# EAGLE board MonthCalendar_Controller_v0.9 (EAGLE 9.4.1)
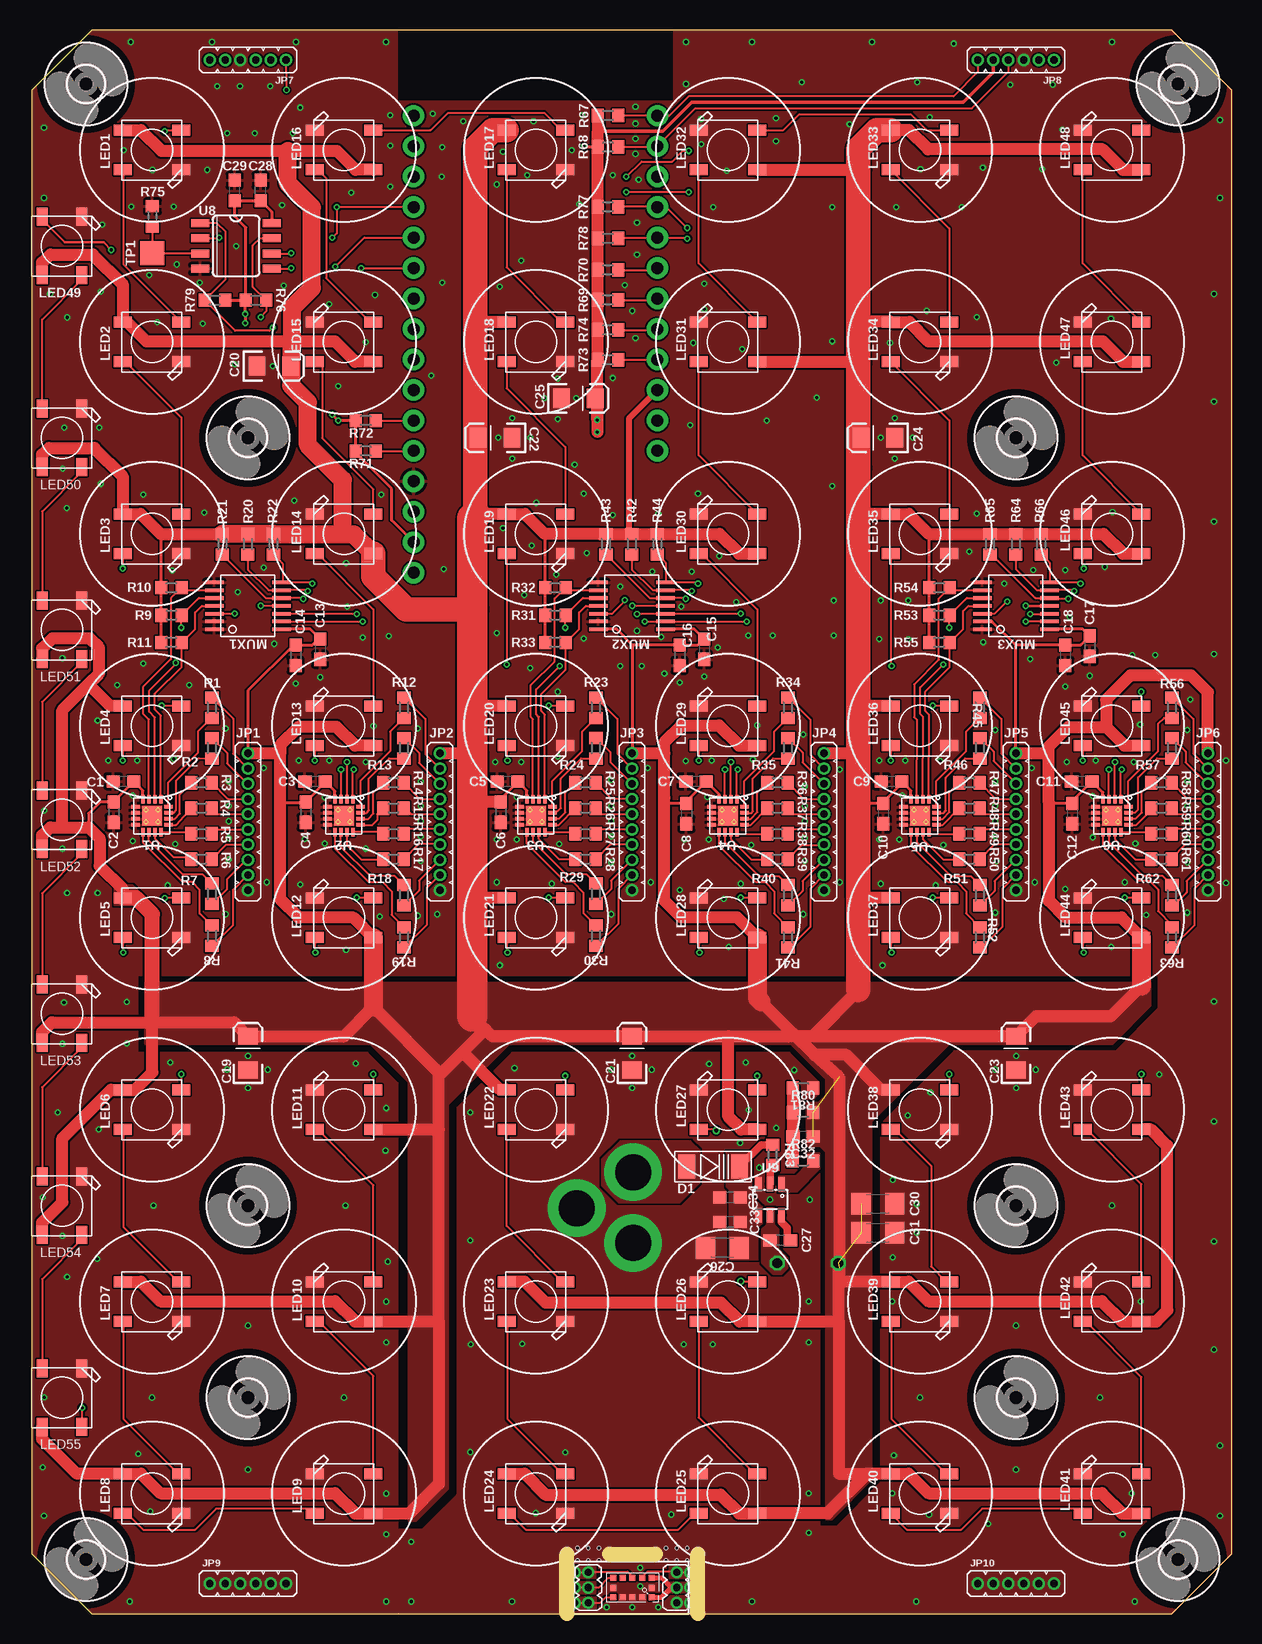
[diagram p5: board, top side]
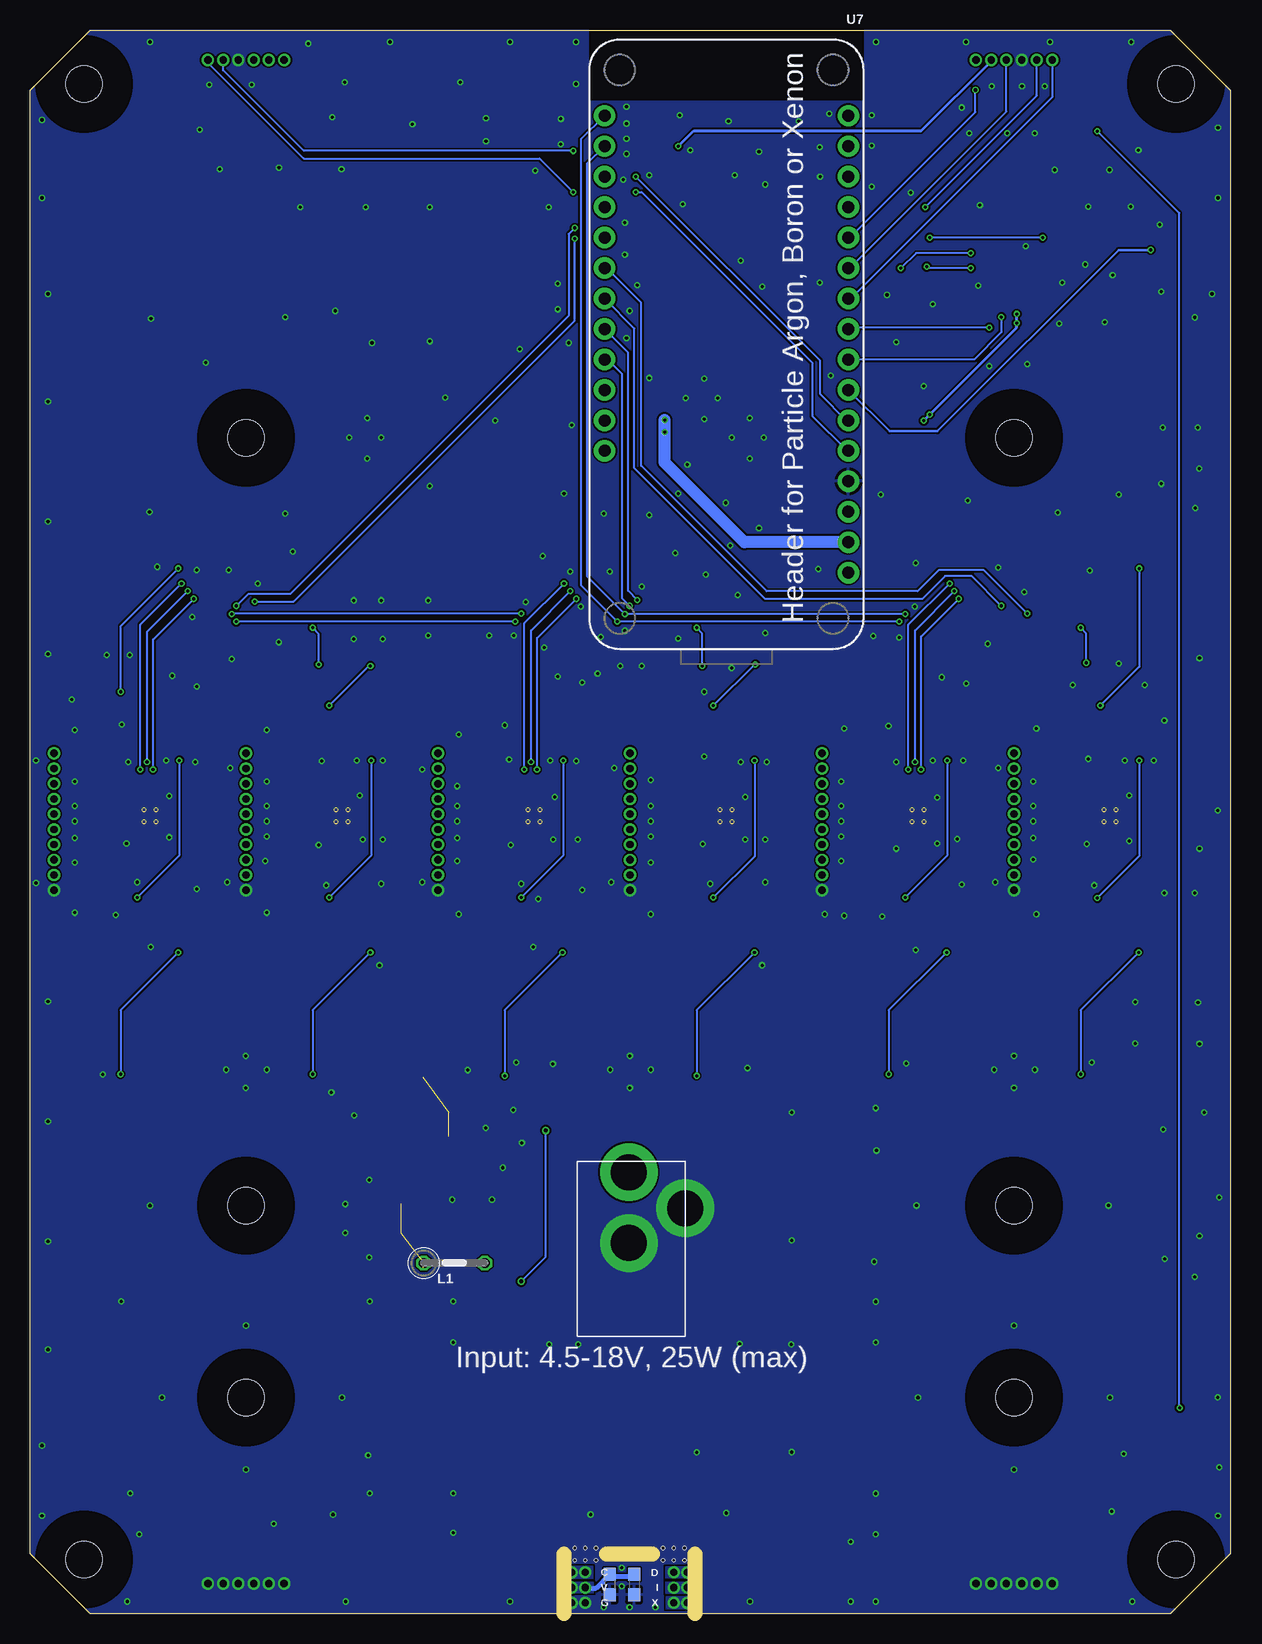
[diagram p6: board, bottom side, seen from below]

Size 100 x 132 mm. Coordinates in mm from the lower left corner, seen from the top.
Outline: 0,127 0,5 5,0 95,0 100,5 100,127 95,132 5,132 0,127
Copper layers (1*16): Top 0.035559375mm / dielectric 1.6mm / Bottom 0.035559375mm
Design rules "oshpark-2layer-tented *": minimum track width 6mil, minimum drill 10mil, track to track 6mil, track to pad 6mil, pad to pad 6mil, via to via 6mil, smd to smd 6mil, copper to edge 0mil, drill to drill 6mil, minimum pad ring 5mil, minimum via ring 5mil, stop-mask expansion 2.5mil, vias tented up to drill 20mil, thermal gap 10mil
Holes 0.25 mm at 47.24,4.45 46.35,4.45 45.47,4.45 47.24,5.46 46.35,5.46 45.47,5.46 54.61,5.46 53.72,5.46 52.83,5.46 54.61,4.45 53.72,4.45 52.83,4.45
Milling: 3 lines

## Footprints (pad centres in the part's own frame; a part is rotated, then mirrored left to right if it is on the bottom)
C0603 = smd 1.1 x 1: 1 -0.85,0; 2 0.85,0
PINHEAD_1X3_50MIL = drill 0.6 pad 1: P$1 0,1.27; P$2 0,0; P$3 0,-1.27
VL53L0X = smd 0.5 x 0.5: 1 1.6,-0.8; 2 0.8,-0.8; 3 0,-0.8; 4 -0.8,-0.8; 5 -1.6,-0.8; 6 -1.6,0; 7 -1.6,0.8; 8 -0.8,0.8; 9 0,0.8; 10 0.8,0.8; 11 1.6,0.8; 12 1.6,0
EIA3216 = smd 1.4 x 1.6: A 1.4,0; C -1.4,0
C1206 = smd 1.6 x 1.8: 1 -1.4,0; 2 1.4,0
SOD-128 = smd 2 x 1.4: ANODE 0,-2.2; CATHODE 0,2.2
CON_PINHEADER_10P_1R_TH_HARWIN_M50-3531042 = drill 0.6 pad 1.016: 1 -5.715,0; 2 -4.445,0; 3 -3.175,0; 4 -1.905,0; 5 -0.635,0; 6 0.635,0; 7 1.905,0; 8 3.175,0; 9 4.445,0; 10 5.715,0
CON_PINHEADER_6P_1R_TH_HARWIN_M50-3530642 = drill 0.6 pad 1.016: 1 -3.175,0; 2 -1.905,0; 3 -0.635,0; 4 0.635,0; 5 1.905,0; 6 3.175,0
0207/5V = drill 0.813 octagon: 1 -2.54,0; 2 2.54,0
WS2812B = smd 1.5 x 0.9: 1-VDD 2.45,-1.65; 2-DOUT 2.45,1.65; 3-GND -2.45,1.65; 4-DIN -2.45,-1.65
TSSOP-14 = smd 0.3 x 1.55: 1 -1.95,2.8; 2 -1.3,2.8; 3 -0.65,2.8; 4 0,2.8; 5 0.65,2.8; 6 1.3,2.8; 7 1.95,2.8; 8 1.95,-2.8; 9 1.3,-2.8; 10 0.65,-2.8; 11 0,-2.8; 12 -0.65,-2.8; 13 -1.3,-2.8; 14 -1.95,-2.8
PJ-102A = drill 3 pad 4.8: RING 0.1,-3.39; RING_SW -4.6,-6.29; TIP 0.1,-9.29
R0603 = smd 1 x 1.1: 1 -0.85,0; 2 0.85,0
TP20SQ = smd 2 x 2: TP 0,0
QFN-16-3X3 = smd 0.69 x 0.28: 1 -1.37,0.75; 2 -1.37,0.25; 3 -1.37,-0.25; 4 -1.37,-0.75; 9 1.37,-0.75; 10 1.37,-0.25; 11 1.37,0.25; 12 1.37,0.75 | smd 0.28 x 0.69: 5 -0.75,-1.37; 6 -0.25,-1.37; 7 0.25,-1.37; 8 0.75,-1.37; 13 0.75,1.37; 14 0.25,1.37; 15 -0.25,1.37; 16 -0.75,1.37 | smd 1.6 x 1.6: PAD 0,0
ARGON = drill 1 pad 1.778: 1 1.27,44.45; 2 1.27,41.91; 3 1.27,39.37; 4 1.27,36.83; 5 1.27,34.29; 6 1.27,31.75; 7 1.27,29.21; 8 1.27,26.67; 9 1.27,24.13; 10 1.27,21.59; 11 1.27,19.05; 12 1.27,16.51; 13 1.27,13.97; 14 1.27,11.43; 15 1.27,8.89; 16 1.27,6.35; 17 21.59,6.35; 18 21.59,8.89; 19 21.59,11.43; 20 21.59,13.97; 21 21.59,16.51; 22 21.59,19.05; 23 21.59,21.59; 24 21.59,24.13; 25 21.59,26.67; 26 21.59,29.21; 27 21.59,31.75; 28 21.59,34.29
SOIC-8_NARROW = smd 0.66 x 1.524: 1 -1.905,-2.973; 2 -0.635,-2.973; 3 0.635,-2.973; 4 1.905,-2.973; 5 1.905,2.973; 6 0.635,2.973; 7 -0.635,2.973; 8 -1.905,2.973
SOT-23-6 = smd 0.55 x 1.2: 1 -0.95,-1.3; 2 0,-1.3; 3 0.95,-1.3; 4 0.95,1.3; 5 0,1.3; 6 -0.95,1.3
3,0 = hole 3: 0,0

## Placement (x,y rotation side)
BO_C1  0.1uF  [C0603]  49.66,2.41 270 bottom
BO_C2  1uF  [C0603]  51.69,2.41 270 bottom
BO_JP1  PINHEAD_1X350MIL  [PINHEAD_1X3_50MIL]  53.72,2.16 180 top
BO_JP2  PINHEAD_1X350MIL  [PINHEAD_1X3_50MIL]  46.35,2.16 180 top
BO_U1  VL53L0X  [VL53L0X]  50.04,2.16 0 top
C1  0.1uF  [C0603]  7.62,69.36 180 top
C2  1uF  [C0603]  6.8,66.8 270 top
C3  0.1uF  [C0603]  23.6,69.36 180 top
C4  1uF  [C0603]  22.81,66.8 270 top
C5  0.1uF  [C0603]  39.62,69.36 180 top
C6  1uF  [C0603]  39.06,66.8 270 top
C7  0.1uF  [C0603]  55.35,69.36 180 top
C8  1uF  [C0603]  54.54,66.68 270 top
C9  0.1uF  [C0603]  71.62,69.36 180 top
C10  1uF  [C0603]  70.92,66.68 270 top
C11  0.1uF  [C0603]  87.48,69.36 180 top
C12  1uF  [C0603]  86.67,66.68 270 top
C13  0.1uF  [C0603]  24,80.39 270 top
C14  1uF  [C0603]  21.97,79.88 270 top
C15  0.1uF  [C0603]  56.01,80.39 270 top
C16  1uF  [C0603]  53.98,79.88 270 top
C17  0.1uF  [C0603]  88.14,80.64 270 top
C18  1uF  [C0603]  86.11,79.88 270 top
C19  47uF  [EIA3216]  18,46.73 90 top
C20  47uF  [EIA3216]  20.15,103.97 0 top
C21  47uF  [EIA3216]  50,46.73 90 top
C22  47uF  [EIA3216]  38.6,98 180 top
C23  47uF  [EIA3216]  82,46.73 90 top
C24  47uF  [EIA3216]  70.5,98 180 top
C25  47uF  [EIA3216]  45.53,101.3 0 top
C26  22uF  [C1206]  57.53,30.48 180 top
C27  0.1uF  [C0603]  62.36,31.11 180 top
C28  0.1uF  [C0603]  19.05,118.62 90 top
C29  1uF  [C0603]  16.89,118.62 90 top
C30  22uF  [C1206]  70.48,34.16 0 top
C31  22uF  [C1206]  70.48,31.75 0 top
C32  47-82pF  [C0603]  64.26,39.75 180 top
C33  0.1uF  [C0603]  58.17,32.64 180 top
C34  1uF  [C0603]  58.17,34.67 180 top
D1  DIODE  [SOD-128]  56.75,37.25 270 top
JP1  CON_10POS_1ROWHARWIN_M3531042  [CON_PINHEADER_10P_1R_TH_HARWIN_M50-3531042]  18,66 270 top
JP2  CON_10POS_1ROWHARWIN_M3531042  [CON_PINHEADER_10P_1R_TH_HARWIN_M50-3531042]  34,66 270 top
JP3  CON_10POS_1ROWHARWIN_M3531042  [CON_PINHEADER_10P_1R_TH_HARWIN_M50-3531042]  50,66 270 top
JP4  CON_10POS_1ROWHARWIN_M3531042  [CON_PINHEADER_10P_1R_TH_HARWIN_M50-3531042]  66,66 270 top
JP5  CON_10POS_1ROWHARWIN_M3531042  [CON_PINHEADER_10P_1R_TH_HARWIN_M50-3531042]  82,66 270 top
JP6  CON_10POS_1ROWHARWIN_M3531042  [CON_PINHEADER_10P_1R_TH_HARWIN_M50-3531042]  98,66 270 top
JP7  CON_6POS_1ROW6P1R_M50_35306  [CON_PINHEADER_6P_1R_TH_HARWIN_M50-3530642]  18,129.5 180 top
JP8  CON_6POS_1ROW6P1R_M50_35306  [CON_PINHEADER_6P_1R_TH_HARWIN_M50-3530642]  82,129.5 180 top
JP9  CON_6POS_1ROW6P1R_M50_35306  [CON_PINHEADER_6P_1R_TH_HARWIN_M50-3530642]  18,2.5 0 top
JP10  CON_6POS_1ROW6P1R_M50_35306  [CON_PINHEADER_6P_1R_TH_HARWIN_M50-3530642]  82,2.5 0 top
L1  4.7uH  [0207/5V]  64.64,29.21 0 bottom
LED1  WS2812B5050  [WS2812B]  10,122 180 top
LED2  WS2812B5050  [WS2812B]  10,106 180 top
LED3  WS2812B5050  [WS2812B]  10,90 180 top
LED4  WS2812B5050  [WS2812B]  10,74 180 top
LED5  WS2812B5050  [WS2812B]  10,58 180 top
LED6  WS2812B5050  [WS2812B]  10,42 180 top
LED7  WS2812B5050  [WS2812B]  10,26 180 top
LED8  WS2812B5050  [WS2812B]  10,10 180 top
LED9  WS2812B5050  [WS2812B]  26,10 0 top
LED10  WS2812B5050  [WS2812B]  26,26 0 top
LED11  WS2812B5050  [WS2812B]  26,42 0 top
LED12  WS2812B5050  [WS2812B]  26,58 0 top
LED13  WS2812B5050  [WS2812B]  26,74 0 top
LED14  WS2812B5050  [WS2812B]  26,90 0 top
LED15  WS2812B5050  [WS2812B]  26,106 0 top
LED16  WS2812B5050  [WS2812B]  26,122 0 top
LED17  WS2812B5050  [WS2812B]  42,122 180 top
LED18  WS2812B5050  [WS2812B]  42,106 180 top
LED19  WS2812B5050  [WS2812B]  42,90 180 top
LED20  WS2812B5050  [WS2812B]  42,74 180 top
LED21  WS2812B5050  [WS2812B]  42,58 180 top
LED22  WS2812B5050  [WS2812B]  42,42 180 top
LED23  WS2812B5050  [WS2812B]  42,26 180 top
LED24  WS2812B5050  [WS2812B]  42,10 180 top
LED25  WS2812B5050  [WS2812B]  58,10 0 top
LED26  WS2812B5050  [WS2812B]  58,26 0 top
LED27  WS2812B5050  [WS2812B]  58,42 0 top
LED28  WS2812B5050  [WS2812B]  58,58 0 top
LED29  WS2812B5050  [WS2812B]  58,74 0 top
LED30  WS2812B5050  [WS2812B]  58,90 0 top
LED31  WS2812B5050  [WS2812B]  58,106 0 top
LED32  WS2812B5050  [WS2812B]  58,122 0 top
LED33  WS2812B5050  [WS2812B]  74,122 180 top
LED34  WS2812B5050  [WS2812B]  74,106 180 top
LED35  WS2812B5050  [WS2812B]  74,90 180 top
LED36  WS2812B5050  [WS2812B]  74,74 180 top
LED37  WS2812B5050  [WS2812B]  74,58 180 top
LED38  WS2812B5050  [WS2812B]  74,42 180 top
LED39  WS2812B5050  [WS2812B]  74,26 180 top
LED40  WS2812B5050  [WS2812B]  74,10 180 top
LED41  WS2812B5050  [WS2812B]  90,10 0 top
LED42  WS2812B5050  [WS2812B]  90,26 0 top
LED43  WS2812B5050  [WS2812B]  90,42 0 top
LED44  WS2812B5050  [WS2812B]  90,58 0 top
LED45  WS2812B5050  [WS2812B]  90,74 0 top
LED46  WS2812B5050  [WS2812B]  90,90 0 top
LED47  WS2812B5050  [WS2812B]  90,106 0 top
LED48  WS2812B5050  [WS2812B]  90,122 0 top
LED49  WS2812B5050  [WS2812B]  2.5,114 270 top
LED50  WS2812B5050  [WS2812B]  2.5,98 270 top
LED51  WS2812B5050  [WS2812B]  2.5,82 270 top
LED52  WS2812B5050  [WS2812B]  2.5,66.17 270 top
LED53  WS2812B5050  [WS2812B]  2.5,50 270 top
LED54  WS2812B5050  [WS2812B]  2.5,34 270 top
LED55  WS2812B5050  [WS2812B]  2.5,18 270 top
MUX1  TCA9543A  [TSSOP-14]  18,84 90 top
MUX2  TCA9543A  [TSSOP-14]  50,84 90 top
MUX3  TCA9543A  [TSSOP-14]  82,84 90 top
P1  2.1MMJACKTHM  [PJ-102A]  50,27.5 180 bottom
R1  4.7k  [R0603]  15,75.51 90 top
R2  4.7k  [R0603]  15,72.13 90 top
R3  4.7k  [R0603]  14.13,69.25 0 top
R4  4.7k  [R0603]  14.13,67.13 0 top
R5  4.7k  [R0603]  14.13,65 0 top
R6  4.7k  [R0603]  14.13,62.87 0 top
R7  4.7k  [R0603]  15,59.99 270 top
R8  4.7k  [R0603]  15,56.48 270 top
R9  4.7k  [R0603]  11.63,83.21 180 top
R10  4.7k  [R0603]  11.62,85.52 180 top
R11  4.7k  [R0603]  11.62,80.94 180 top
R12  4.7k  [R0603]  31,75.51 90 top
R13  4.7k  [R0603]  31,72.13 90 top
R14  4.7k  [R0603]  30.13,69.25 0 top
R15  4.7k  [R0603]  30.13,67.13 0 top
R16  4.7k  [R0603]  30.13,65 0 top
R17  4.7k  [R0603]  30.13,62.87 0 top
R18  4.7k  [R0603]  31,59.87 270 top
R19  4.7k  [R0603]  31,56.36 270 top
R20  4.7k  [R0603]  17.99,89.14 90 top
R21  4.7k  [R0603]  15.87,89.14 90 top
R22  4.7k  [R0603]  20.12,89.14 90 top
R23  4.7k  [R0603]  47,75.51 90 top
R24  4.7k  [R0603]  47,72.13 90 top
R25  4.7k  [R0603]  46.13,69.25 0 top
R26  4.7k  [R0603]  46.13,67.13 0 top
R27  4.7k  [R0603]  46.13,65 0 top
R28  4.7k  [R0603]  46.13,62.87 0 top
R29  4.7k  [R0603]  47,59.99 270 top
R30  4.7k  [R0603]  47,56.48 270 top
R31  4.7k  [R0603]  43.62,83.21 180 top
R32  4.7k  [R0603]  43.62,85.52 180 top
R33  4.7k  [R0603]  43.62,80.94 180 top
R34  4.7k  [R0603]  63,75.51 90 top
R35  4.7k  [R0603]  63,72.13 90 top
R36  4.7k  [R0603]  62.13,69.25 0 top
R37  4.7k  [R0603]  62.13,67.13 0 top
R38  4.7k  [R0603]  62.13,65 0 top
R39  4.7k  [R0603]  62.13,62.87 0 top
R40  4.7k  [R0603]  63,59.87 270 top
R41  4.7k  [R0603]  63,56.36 270 top
R42  4.7k  [R0603]  49.99,89.14 90 top
R43  4.7k  [R0603]  47.84,89.14 90 top
R44  4.7k  [R0603]  52.11,89.14 90 top
R45  4.7k  [R0603]  79,75.51 90 top
R46  4.7k  [R0603]  79,72.13 90 top
R47  4.7k  [R0603]  78.13,69.25 0 top
R48  4.7k  [R0603]  78.13,67.13 0 top
R49  4.7k  [R0603]  78.13,65 0 top
R50  4.7k  [R0603]  78.13,62.87 0 top
R51  4.7k  [R0603]  79,59.87 270 top
R52  4.7k  [R0603]  79,56.36 270 top
R53  4.7k  [R0603]  75.61,83.21 180 top
R54  4.7k  [R0603]  75.61,85.52 180 top
R55  4.7k  [R0603]  75.61,80.94 180 top
R56  4.7k  [R0603]  95,75.51 90 top
R57  4.7k  [R0603]  95,72.13 90 top
R58  4.7k  [R0603]  94.13,69.25 0 top
R59  4.7k  [R0603]  94.13,67.13 0 top
R60  4.7k  [R0603]  94.13,65 0 top
R61  4.7k  [R0603]  94.13,62.87 0 top
R62  4.7k  [R0603]  95,59.87 270 top
R63  4.7k  [R0603]  95,56.36 270 top
R64  4.7k  [R0603]  81.99,89.14 90 top
R65  4.7k  [R0603]  79.84,89.14 90 top
R66  4.7k  [R0603]  84.1,89.14 90 top
R67  4.7k  [R0603]  48,124.88 180 top
R68  4.7k  [R0603]  48,122.25 180 top
R69  4.7k  [R0603]  48,109.5 180 top
R70  4.7k  [R0603]  48,112 180 top
R71  4.7k  [R0603]  27.81,96.9 180 top
R72  4.7k  [R0603]  27.81,99.44 180 top
R73  4.7k  [R0603]  48,104.5 180 top
R74  4.7k  [R0603]  48,107 180 top
R75  4.7k  [R0603]  10.03,116.46 270 top
R76  4.7k  [R0603]  18.67,109.47 180 top
R77  4.7k  [R0603]  48,117.25 180 top
R78  4.7k  [R0603]  48,114.63 180 top
R79  4.7k  [R0603]  15.24,109.47 0 top
R80  147k  [R0603]  64.26,41.78 0 top
R81  20k  [R0603]  64.26,43.81 180 top
R82  5k  [R0603]  64.26,37.72 0 top
R83  5k  [R0603]  61.72,38.23 90 top
TP1  TPTP20SQ  [TP20SQ]  10.03,113.41 0 top
U1  CAP1208  [QFN-16-3X3]  10,66.5 270 top
U2  CAP1208  [QFN-16-3X3]  26,66.5 270 top
U3  CAP1208  [QFN-16-3X3]  42,66.5 270 top
U4  CAP1208  [QFN-16-3X3]  58,66.5 270 top
U5  CAP1208  [QFN-16-3X3]  74,66.5 270 top
U6  CAP1208  [QFN-16-3X3]  90,66.5 270 top
U7  ARGON  [ARGON]  30.53,131.21 180 bottom
U8  W25Q32SOIC8_N  [SOIC-8_NARROW]  17,114 270 top
U9  RT6255AHGJ6FCT-ND  [SOT-23-6]  61.51,34.51 180 top
U$1  [PAD_CAPACITIVETOUCH_2_OUTLINE]  10,122 0 top
U$2  [PAD_CAPACITIVETOUCH_2_OUTLINE]  10,106 0 top
U$3  [PAD_CAPACITIVETOUCH_2_OUTLINE]  10,90 0 top
U$4  [PAD_CAPACITIVETOUCH_2_OUTLINE]  10,74 0 top
U$5  [PAD_CAPACITIVETOUCH_2_OUTLINE]  10,58 0 top
U$6  [PAD_CAPACITIVETOUCH_2_OUTLINE]  10,42 0 top
U$7  [PAD_CAPACITIVETOUCH_2_OUTLINE]  10,26 0 top
U$8  [PAD_CAPACITIVETOUCH_2_OUTLINE]  10,10 0 top
U$9  [PAD_CAPACITIVETOUCH_2_OUTLINE]  26,10 0 top
U$10  [PAD_CAPACITIVETOUCH_2_OUTLINE]  26,26 0 top
U$11  [PAD_CAPACITIVETOUCH_2_OUTLINE]  26,42 0 top
U$12  [PAD_CAPACITIVETOUCH_2_OUTLINE]  26,58 0 top
U$13  [PAD_CAPACITIVETOUCH_2_OUTLINE]  26,74 0 top
U$14  [PAD_CAPACITIVETOUCH_2_OUTLINE]  26,90 0 top
U$15  [PAD_CAPACITIVETOUCH_2_OUTLINE]  26,106 0 top
U$16  [PAD_CAPACITIVETOUCH_2_OUTLINE]  26,122 0 top
U$17  [PAD_CAPACITIVETOUCH_2_OUTLINE]  42,10 0 top
U$18  [PAD_CAPACITIVETOUCH_2_OUTLINE]  58,10 0 top
U$19  [PAD_CAPACITIVETOUCH_2_OUTLINE]  74,10 0 top
U$20  [PAD_CAPACITIVETOUCH_2_OUTLINE]  90,10 0 top
U$21  [PAD_CAPACITIVETOUCH_2_OUTLINE]  42,26 0 top
U$22  [PAD_CAPACITIVETOUCH_2_OUTLINE]  58,26 0 top
U$23  [PAD_CAPACITIVETOUCH_2_OUTLINE]  74,26 0 top
U$24  [PAD_CAPACITIVETOUCH_2_OUTLINE]  90,26 0 top
U$25  [PAD_CAPACITIVETOUCH_2_OUTLINE]  90,42 0 top
U$26  [PAD_CAPACITIVETOUCH_2_OUTLINE]  74,42 0 top
U$27  [PAD_CAPACITIVETOUCH_2_OUTLINE]  58,42 0 top
U$28  [PAD_CAPACITIVETOUCH_2_OUTLINE]  42,42 0 top
U$29  [PAD_CAPACITIVETOUCH_2_OUTLINE]  42,58 180 top
U$30  [PAD_CAPACITIVETOUCH_2_OUTLINE]  58,58 0 top
U$31  [PAD_CAPACITIVETOUCH_2_OUTLINE]  74,58 0 top
U$32  [PAD_CAPACITIVETOUCH_2_OUTLINE]  90,58 0 top
U$33  [PAD_CAPACITIVETOUCH_2_OUTLINE]  42,74 180 top
U$34  [PAD_CAPACITIVETOUCH_2_OUTLINE]  58,74 0 top
U$35  [PAD_CAPACITIVETOUCH_2_OUTLINE]  74,74 0 top
U$36  [PAD_CAPACITIVETOUCH_2_OUTLINE]  90,74 0 top
U$37  [PAD_CAPACITIVETOUCH_2_OUTLINE]  42,90 0 top
U$38  [PAD_CAPACITIVETOUCH_2_OUTLINE]  58,90 0 top
U$39  [PAD_CAPACITIVETOUCH_2_OUTLINE]  74,90 0 top
U$40  [PAD_CAPACITIVETOUCH_2_OUTLINE]  90,90 0 top
U$41  [PAD_CAPACITIVETOUCH_2_OUTLINE]  42,106 180 top
U$42  [PAD_CAPACITIVETOUCH_2_OUTLINE]  58,106 0 top
U$43  [PAD_CAPACITIVETOUCH_2_OUTLINE]  74,106 0 top
U$44  [PAD_CAPACITIVETOUCH_2_OUTLINE]  90,106 0 top
U$45  [PAD_CAPACITIVETOUCH_2_OUTLINE]  42,122 0 top
U$46  [PAD_CAPACITIVETOUCH_2_OUTLINE]  58,122 0 top
U$47  [PAD_CAPACITIVETOUCH_2_OUTLINE]  74,122 0 top
U$48  [PAD_CAPACITIVETOUCH_2_OUTLINE]  90,122 0 top
U$49  [3,0]  4.5,4.5 0 top
U$50  [3,0]  18,34 0 top
U$51  [3,0]  82,18 0 top
U$52  [3,0]  18,98 0 top
U$53  [3,0]  4.5,127.5 0 top
U$54  [3,0]  95.5,4.5 0 top
U$55  [3,0]  95.5,127.5 0 top
U$56  [3,0]  18,18 0 top
U$57  [3,0]  82,34 0 top
U$58  [3,0]  82,98 0 top

## Tracks (layer width: path | path; a pad name or v marks a point on that pad's centre or on a via)
!I_ENABLE  (via drill 0.25)
  Top 0.152: v54.74,118.49 v49.53,118.49 | U7.5 31.79,96.9 R71.1
  Bottom 0.152: U7.5 31.79,96.94 31.91,96.94 34.8,99.82 34.8,104.27 49.02,118.49 v49.53,118.49 | JP8.1 85.17,129.28 77.18,121.28 57.53,121.28 v54.74,118.49
!INT1  (via drill 0.25)
  Top 0.152: MUX1.11 v19.05,84 | R69.1 52,109.5 U7.23
  Bottom 0.152: v19.05,84 21.54,86.49 23.75,86.49 25.65,84.58 38.73,84.58 49.63,95.47 49.63,107.12 U7.23
!INT2  (via drill 0.25)
  Top 0.152: MUX2.11 v50.04,84 | R73.1 48.89,104.54 U7.25
  Bottom 0.152: U7.25 51.87,104.54 50.67,103.34 50.67,84.64 v50.04,84
!INT3  (via drill 0.25)
  Top 0.152: R77.1 52.11,117.25 U7.20
  Top 0.203: MUX3.11 v82.8,84 | v54.61,115.5 52.87,117.24 U7.20
  Bottom 0.152: v82.8,84 81.79,85.02 78.29,85.02 55.12,108.19 55.12,114.99 v54.61,115.5
!MUX1INT0
  Top 0.152: MUX1.4 14.15,84 13.59,83.44 13.59,82.07 R11.1 12.46,78.91 10.24,76.68 10.24,75.36 10.75,74.85 U1.1
!MUX1INT1  (via drill 0.25)
  Top 0.152: R22.1 20.88,87.52 20.88,86.03 MUX1.8 23.27,85.95 v23.37,85.85 | U2.1 26.75,70.31 v26.8,70.36
  Bottom 0.152: v26.8,70.36 26.8,82.42 v23.37,85.85
!MUX2INT0
  Top 0.152: MUX2.4 46.15,84 45.59,83.44 45.59,82.07 R33.1 44.47,78.67 42.44,76.65 42.44,75.24 42.75,74.93 U3.1
!MUX2INT1  (via drill 0.25)
  Top 0.152: R44.1 52.8,87.6 MUX2.8 55.4,85.95 v55.5,85.85 | U4.1 58.75,70.31 v58.8,70.36
  Bottom 0.152: v58.8,70.36 58.8,82.55 v55.5,85.85
!MUX3INT0
  Top 0.152: MUX3.4 78.03,84 77.6,83.57 77.6,82.08 R55.1 76.47,78.88 74.45,76.86 74.45,75.24 74.77,74.92 U5.1
!RST1  (via drill 0.25)
  Top 0.152: MUX1.3 v16.89,83.35 | R70.1 51.96,112 U7.22
  Bottom 0.152: v16.89,83.35 20.54,87 24.26,87 26.04,85.22 38.61,85.22 49.07,95.68 49.07,109.27 51.95,112.16 U7.22
!RST2  (via drill 0.25)
  Top 0.152: MUX2.3 48.34,83.35 49.4,84.41 v49.4,84.49 | R74.1 52.04,107 U7.24
  Bottom 0.152: v49.4,84.49 50.16,85.25 50.16,105.12 U7.24
!RST3  (via drill 0.25)
  Top 0.152: v81.28,84.37 81.23,84.37 80.22,83.35 MUX3.3 | R78.1 48.92,114.7 U7.21 54.52,114.7 v54.61,114.61
  Bottom 0.152: v81.28,84.37 78.03,84.37 54.61,107.79 v54.61,114.61
!XSHUT1  (via drill 0.6 pad 1.05)
  Top 0.152: BO_U1.5 47.82,1.36 47.35,0.89 46.48,0.89 BO_JP2.P$1 v45.21,0.89
  pour Top: 44.58,1.35 46.99,1.35 46.99,0.43 44.58,0.43
  pour Bottom: 44.58,1.35 46.99,1.35 46.99,0.43 44.58,0.43
+3V3  (via drill 0.25)
  Top 0.254: U7.2 29.97,91.13 29.97,93.77 26.96,96.77 R71.2 R72.2 v25.53,99.44 v25.02,99.95 | R68.2 46.03,122.25 v45.97,122.3 | R79.2 17.78,109.47 | 17.78,109.47 R76.2 17.82,115.53 16.89,116.46 C29.1 C28.1 19.97,116.84 U8.8 | 17.78,109.47 v17.78,108.33 v17.78,107.57
  Top 0.305: 47.12,104.47 R73.2 | 47.15,122.3 R68.2 | 47.15,124.46 R67.2 | 47.15,111.89 R70.2 | 47.15,123.57 52.58,123.57 54.98,125.97 77.59,125.97 80.09,128.47 JP8.5
  Top 1.016: v47.12,99.5 47.12,104.47 | R73.2 R74.2 R69.2 47.15,111.89 | R70.2 R78.2 R77.2 47.15,122.3 | R68.2 47.15,123.57 47.15,124.46 | C25.A 47.12,101.3 v47.12,99.5 | v47.12,99.5 v47.12,98.48
  Bottom 0.254: v45.97,122.3 44.69,123.59 25.73,123.59 19.91,129.41 JP7.2 | v25.53,99.44 v25.02,99.95 17.78,107.19 v17.78,107.57 v17.78,108.33
  Bottom 1.016: U7.2 40.47,89.3 47.12,95.94 v47.12,99.5
+5V  (5 unrouted)
  Top 0.203: R65.2 R64.2 82.04,89.98 R66.2 84.07,89.98
  Top 0.254: MUX1.14 23.19,82.05 C13.1 23.88,81.24 23.37,80.73 C14.1 21.8,80.73 18,76.93 JP1.1 | MUX2.14 55.2,82.05 C15.1 55.5,80.73 C16.1 50.04,80.73 | MUX3.14 87.58,82.05 C17.1 87.38,80.73 C18.1 81.96,80.73 | R55.2 R53.2 R54.2 74.77,89.95 74.8,89.98 | 52.7,68 53.18,67.53 C8.1 54.54,67.7 C7.1 57.25,68.31 U4.4 | R33.2 R31.2 R32.2 42.77,89.82 42.93,89.98 | R11.2 10.77,83.2 R9.2 10.78,85.5 R10.2 10.77,89.95 10.79,89.98 | U6.4 89.25,68.44 C11.1 86.67,67.71 C12.1 84.87,67.53 84.71,67.69 | U2.4 25.25,68.56 C3.1 24.45,69.29 C4.1 22.72,67.56 20.7,67.56 | U5.4 73.25,68.58 C9.1 72.47,69.2 70.92,67.65 C10.1 69.03,67.53 68.87,67.69 | U3.4 41.25,68.58 C5.1 40.47,69.32 39.06,67.91 C6.1 | U1.4 9.25,68.58 C1.1 6.8,67.7 C2.1 5.68,67.65 4.72,66.7 4.72,65.53 | 50.04,80.73 50.04,71.75 JP3.1 | JP5.1 82,80.73 81.97,80.73 81.96,80.73 | 50.04,80.73 48.77,82 48.77,82.04 48.76,82.05 MUX2.1 | MUX3.2 80,82.7 81.96,80.73
  Top 0.508: U7.26 49.74,99.62 49.74,90.24 49.49,89.98 R43.2
  Top 1.016: 20.7,71.75 20.7,67.56 20.7,59.53 22.23,58 26.8,58 LED12.1-VDD | 20.7,71.75 20.7,72.39 22.23,73.91 25.36,73.91 26.93,72.35 LED13.1-VDD | LED28.1-VDD 58.76,58.04 54.1,58.04 52.7,59.44 52.7,68 52.7,71.72 | 52.7,71.72 52.7,72.64 54.1,74.04 57.23,74.04 58.93,72.35 LED29.1-VDD | LED15.1-VDD 26.93,104.35 25.23,106.05 21.64,106.05 | LED44.1-VDD 90.81,57.99 90.81,58.04 86.11,58.04 84.71,59.44 84.71,67.69 84.71,71.72 | LED45.1-VDD 91.05,72.35 89.51,73.89 | 89.51,73.89 89.49,73.91 86.36,73.91 84.71,72.26 84.71,71.72 | R21.2 10.79,89.98 10.73,89.98 9.06,91.65 LED3.1-VDD 7.55,94.81 5.21,97.16 1.4,97.16 0.85,96.61 LED50.1-VDD | LED30.1-VDD 58.93,88.35 57.29,89.98 R44.2 R42.2 R43.2 42.93,89.98 42.74,89.98 41.07,91.65 LED19.1-VDD 37.03,91.65 | 82.04,89.98 R65.2 74.8,89.98 74.74,89.98 73.07,91.65 LED35.1-VDD 69.04,91.65 68.87,91.82 | R64.2 84.07,89.98 | R66.2 89.29,89.98 90.93,88.35 LED46.1-VDD | LED47.1-VDD 90.93,104.35 89.23,106.05 74.69,106.05 73.13,107.65 LED34.1-VDD 71.5,107.7 68.87,107.7 | LED48.1-VDD 90.93,120.35 89.23,122.05 74.68,122.05 73.07,123.65 LED33.1-VDD | LED1.1-VDD 9.06,123.65 10.79,121.92 21.33,121.92 25.4,121.92 26.97,120.35 LED16.1-VDD | LED37.1-VDD 68.91,59.65 68.87,59.69 | LED36.1-VDD 69.04,75.65 68.87,75.82 | LED31.1-VDD 68.79,104.35 68.87,104.27 | LED18.1-VDD 36.99,107.65 36.95,107.7 | 37.03,91.65 36.95,91.57 | 34.04,44.96 28.45,50.54 26.03,48.12 C19.A 16.85,49.28 9.91,49.28 | C22.A 37.2,91.82 37.03,91.65 | 37.78,48.7 38.35,48.12 C21.A 58.04,48.12 | 36.69,49.78 37.78,48.7 | 65.22,46.55 67.27,44.72 67.27,28.83 | 65.22,46.55 63.37,48.39 | 60.77,50.99 63.37,48.39
  Top 1.016: 34.04,44.96 35.88,46.8 | 35.88,46.8 37.78,48.7 | LED22.1-VDD 39.03,43.65 35.88,46.8 | LED38.1-VDD 70.78,43.65 67.88,46.55 65.22,46.55 | 92.45,52.31 89.92,49.78 83.65,49.78 C23.A 65.02,48.12 | 58.04,48.12 63.11,48.12 | 63.11,48.12 63.37,48.39 | 68.87,51.98 65.02,48.12 | 65.02,48.12 63.11,48.12 | JP6.1 98,76.8 96.6,78.19 91.53,78.19 89.51,76.18 89.51,73.89 | JP3.1 52.7,71.72 | JP5.1 84.71,71.72 | JP4.1 68.44,71.72 68.87,72.15 | 69.59,11.65 66.29,8.35 LED25.1-VDD 58.93,8.35 57.37,9.9 42.79,9.9 41.05,11.65 LED24.1-VDD | 69.59,11.65 LED40.1-VDD 73.06,11.65 74.68,10.03 89.15,10.03 90.84,8.35 LED41.1-VDD | 69.59,11.65 67.23,11.65 67.23,24.35 | 67.27,28.83 67.27,27.65 LED39.1-VDD 73.06,27.65 74.68,26.04 89.15,26.04 90.84,24.35 LED42.1-VDD 93.69,24.35 94.61,25.27 94.61,38.99 93.25,40.35 LED43.1-VDD | 67.23,24.35 67.23,28.79 67.27,28.83 | 67.23,24.35 LED26.1-VDD 58.96,24.35 57.4,25.91 42.8,25.91 41.06,27.65 LED23.1-VDD | C24.A 69.1,95.73 68.87,95.5 | LED32.1-VDD 68.82,120.35 68.87,120.4 | JP1.1 20.66,71.72 20.7,71.75 | LED7.1-VDD 9.07,27.65 10.69,26.04 25.24,26.04 26.93,24.35 LED10.1-VDD 33.91,24.35 | LED55.1-VDD 0.85,14.53 3.73,11.65 LED8.1-VDD 9.07,11.65 10.69,10.03 25.24,10.03 26.93,8.35 LED9.1-VDD 31.46,8.35 33.91,10.79 33.91,24.35 | LED54.1-VDD 0.85,32.6 2.54,34.29 2.54,39.62 6.57,43.65 LED6.1-VDD 8.57,43.65 10.03,45.12 10.03,49.4 9.91,49.28 | LED53.1-VDD 0.85,48.48 1.65,49.28 9.91,49.28 | LED52.1-VDD 0.85,64.86 1.52,65.53 2.54,65.53 | 2.54,65.53 4.72,65.53 5.64,64.61 5.64,62.33 7.55,60.42 LED5.1-VDD | LED49.1-VDD 0.85,112.61 1.52,113.28 5.08,113.28 7.55,110.81 LED2.1-VDD 7.93,107.65 9.54,106.05 21.64,106.05
  Top 1.016: 2.54,65.53 2.54,75.31 4.7,77.47 | 4.7,77.47 5.59,78.36 5.59,80.52 4.83,81.28 1.69,81.28 0.85,80.44 LED51.1-VDD | LED4.1-VDD 6.52,75.65 4.7,77.47 | LED20.1-VDD 36.86,75.65 36.69,75.82 | JP2.1 36.6,71.72 36.69,71.63 | C6.1 36.78,67.65 36.69,67.56 | C20.A 21.59,103.93 21.59,102.36 | LED21.1-VDD 36.73,59.65 36.69,59.69 | 21.64,106.05 21.59,105.99 | 33.91,24.35 33.91,40.35 | LED11.1-VDD 33.91,40.35 | LED27.1-VDD 59.09,40.35 58.04,41.4 58.04,48.12 | 33.91,40.35 33.91,44.83 34.04,44.96
  Top 1.27: 10.03,49.4 10.03,58.29 8.68,59.65 LED5.1-VDD
  Top 1.5: LED14.1-VDD 26.83,89.96 25.91,89.96 | 25.91,89.96 20.15,89.96 R22.2 R20.2 R21.2 | 21.33,121.92 21.33,119.22 23.32,117.23 23.32,110.48 21.64,108.8 21.64,106.05 | 25.91,89.96 25.91,94.49 22.99,97.41 22.99,100.97 21.59,102.36 21.59,105.99
  Top 1.58: LED12.1-VDD 28.45,50.54 | LED28.1-VDD 60.45,51.31 60.77,50.99 | LED44.1-VDD 92.45,52.31
  Top 2.032: 36.95,91.57 36.95,107.7 36.95,122.19 38.41,123.65 LED17.1-VDD | 68.87,51.98 68.87,59.69 68.87,67.69 68.87,72.15 68.87,75.82 68.87,91.82 68.87,95.5 68.87,104.27 68.87,107.7 68.87,120.4 68.87,122.11 70.41,123.65 LED33.1-VDD | LED14.1-VDD 28.45,86.44 31.2,83.69 36.69,83.69
  Top 2.54: 36.95,91.57 36.69,91.31 36.69,83.69 36.69,75.82 36.69,71.63 36.69,67.56 36.69,59.69 36.69,49.78
  pour Top: 9.4,52.58 9.4,47.5 28.19,47.5 31.37,44.32 31.37,7.75 32,7.75 34.67,10.41 34.67,42.42 39.75,47.5 63.25,47.5 66.17,44.58 66.17,43.18 65.53,42.55 64.52,42.55 64.52,38.99 65.66,38.99 66.17,38.48 66.17,7.87 66.67,7.87 69.98,11.18 69.98,41.02 76.45,47.5 90.04,47.5 93.22,50.67 93.22,52.58
  pour Top: 6.86,59.05 8.51,59.05 9.27,59.82 8.38,60.71 6.86,60.71
BOOT
  Top 0.61: C27.1 62.95,31.37 62.95,32.13 62.46,32.63 U9.6
CLK  (via drill 0.25)
  Top 0.152: U8.6 21.54,113.36 v21.59,113.41 | v27.43,112.14 31.79,112.14 U7.11
  Bottom 0.152: JP7.3 18.64,125.2 31.68,112.16 U7.11 | v21.59,113.41 26.16,113.41 v27.43,112.14
CS
  Bottom 0.152: JP7.6 14.82,126.39 31.6,109.62 U7.10
CS2  (via drill 0.25)
  Top 0.152: U8.1 15.41,115.91 16.13,115.19 16.13,111.21 R79.1 16.93,106.93 19.81,106.93 v20.07,107.19
  Bottom 0.152: v20.07,107.19 31.69,107.19 U7.9
EN
  Top 0.61: R83.1 61.51,37.16 U9.2
FB
  pour Top: 65.66,38.35 64.64,38.35 64.64,37.47 63.63,36.45 62.23,36.45 62.23,35.18 63.75,35.18 65.66,37.08
GND  (via drill 0.25, 0.6 pad 1.05)
  other vias: 86.23,70.99 88.65,71.12 91.82,70.99 8.38,64.39 8.38,68.2 8.76,71.12 11.3,60.71 5.46,60.07 27.81,70.99 24.77,71.12 22.23,71.12 43.31,60.83 38.73,60.96 38.73,64.52 40.39,64.52 40.39,68.07 40.77,70.99 38.61,70.99 59.05,60.83 53.98,60.33 54.36,64.52 56.39,64.52 56.26,68.07 56.64,71.12 72.26,64.52 75.31,60.71 70.74,60.83 70.61,64.52 72.52,68.2 72.77,71.12 70.61,71.12 54.86,0.89 50.7,3.81 47.88,0.51 50.04,0.51 52.2,0.51 50.67,2.29 51.69,86.87 46.23,88.39 49.02,85.6 43.69,86.61 45.97,81.28 50.42,81.92 54.1,83.95 54.99,86.87 57.28,88.14 58.67,84.33 59.69,81.53 57.15,80.52 56.01,78.11 52.7,78.36 53.98,77.6 50.8,78.99 52.45,81.41 43.81,76.83 49.02,78.99 2.9,92.16 1.5,110 29.51,42.13 29.51,22.62 29.51,26 29.51,6.62 29.51,10 31.62,5.98 36.57,22.43 29.51,1 31.62,1 57.66,59.56 44.45,13.44 29.46,38.59 29.64,29.33 26.97,45.84 7.89,47.53 16.25,45.34 19.64,45.34 18,43.81 18,46.48 1,8.16 16.89,104.14 20.07,103.98 2.92,108.04 40.01,96.26 40.01,99.64 41.53,98.01 38.87,98.01 43.82,99.57 43.82,102.95 45.34,101.31 42.68,101.31 71.89,96.26 71.89,99.64 73.41,98.01 70.74,98.01 48.26,45.34 51.64,45.34 50,43.81 50,46.48 80.26,45.34 83.64,45.34 82.01,43.81 82.01,46.48 99.5,71.09 99.5,60.91 98.5,31.02 98.5,51.02 98.5,41.02 98.5,79.99 98.5,91.02 98.5,101.02 98.5,110 98.5,22 99,14 99,8.13 99,118 99,124.5 1,118 1,123.86 29.5,131 54.5,131 60,131 70,131 76.83,130.87 90,131 8.22,131 15.43,127.32 19.85,127.32 54.5,127.5 55.76,122.49 62,124.65 68.13,124.14 62,122.75 34.17,122.24 39.25,121.86 44.97,121.98 41.79,124.4 35.95,124.4 33.41,125.03 45.86,124.9 29.85,124.9 29.85,122.36 29.85,118.94 17.03,113.98 7.63,121.98 10.04,120.33 10.42,107.63 5.72,110.17 27.82,105.98 5.6,98.87 14.36,91.76 25.54,102.3 29.09,93.28 34.17,110.93 33.28,103.19 34.3,87.06 9.28,79.18 7.12,77.41 5.72,94.17 11.69,86.93 17.15,85.15 19.31,87.19 39.25,90.49 41.03,84.9 38.74,81.72 41.54,78.8 26.17,87.57 13.09,77.41 21.98,77.53 24.01,78.04 27.57,81.34 28.46,73.98 43.82,71.44 7.88,50.99 26.17,55.31 22.36,60.77 24.39,64.2 24.39,68.01 28.96,58.1 39,54.04 58.05,55.56 70.88,54.04 89.92,55.56 86.11,60.39 92.85,58.23 88.4,68.14 88.4,64.71 91.96,64.2 92.34,74.1 86.11,77.28 88.15,78.17 75.7,71.06 79.26,80.96 73.03,81.22 70.62,81.22 83.19,79.56 75.95,64.07 59.95,64.07 60.08,71.18 54.49,71.06 66.8,84.45 73.03,84.45 78.11,88.52 83.44,87 91.69,79.88 86.11,87 81.03,85.85 86.49,83.06 55.12,105.92 65.41,101.35 56.01,108.71 71.5,105.92 56.77,117.22 57.91,120.27 66.67,117.22 66.67,106.05 79.25,120.52 74.04,120.4 72.01,117.22 74.55,108.58 77.47,117.22 84.2,120.4 85.85,123.7 74.8,124.71 81.53,127.44 89.92,107.95 90.04,91.82 55.5,93.34 66.67,93.98 61.21,99.44 70.74,84.45 93.6,79.88 48.39,91.57 52.2,91.69 54.86,99.06 85.34,104.27 78.74,91.69 78.74,108.08 73.79,127.64 64.14,127.64 55.75,124.59 50.29,125.6 50.29,124.21 50.29,122.94 50.29,121.67 50.55,119.51 48.39,119.89 50.42,115.95 50.42,113.28 50.04,108.58 49.4,110.74 50.29,106.3 48.39,103 56.01,110.87 59.18,105.41 40.77,112.78 38.99,110.62 45.59,117.47 41.27,119.89 38.73,119.13 34.16,119.76 29.73,81.47 66.8,81.53 61.72,81.53 60.45,74.04 96.27,66.04 91.06,60.96 80.26,66.04 83.31,70.48 83.57,60.96 96.27,69.34 80.26,73.66 96.27,73.66 96.27,58.42 80.26,58.42 67.31,70.36 67.31,60.96 64.39,66.04 64.39,68.96 80.26,69.34 64.26,58.29 51.31,70.48 51.56,60.96 48.26,66.04 48.26,69.47 43.94,64.14 48.26,58.29 32.38,69.34 32.38,66.04 27.81,63.75 32.13,58.17 33.78,58.29 19.56,60.96 11.94,64.14 11.81,71.25 6.35,71.12 20.2,80.83 21.85,92.77 89.41,87.25 93.93,44.95 92.4,26.03 74.88,43.43 72.97,41.52 71.71,36.16 71.7,26.03 71.83,13.2 90.88,6.6 91.64,10.03 82,12 71.7,10.03 73.68,1 60,1 91.91,1 40,1 82,24 40.84,22.47 36.52,13.46 59,39.24 64.72,26.03 64.72,10.03 40.21,45.46 18,24 8.16,1 54.32,22.44 90,34 14.23,107.5 45.97,93.34 45.21,95.76 42.04,92.58 22.74,64.58 26.27,83.92 41.64,89 15,131 17.33,127.32 26.6,118.43 22,131 18.55,123.38 85.05,127.44 64.39,67.31 64.39,62.74 64.39,64.64 64.26,73.28 80.26,67.31 80.26,64.77 80.39,62.74 96.27,67.31 96.27,64.64 96.27,62.61 96.52,76.2 48.26,67.31 48.26,64.77 48.26,62.61 32.38,67.31 32.38,64.77 32.38,62.74 32.13,73.79 19.3,70.48 16.38,69.34 16.38,67.31 16.38,66.04 16.38,64.64 16.38,62.87 16.13,73.79 16.13,58.29 14.61,120.33 20.84,117.41 11.82,117.28 8.26,117.28 20.96,110.68 16.27,123.38 21.73,123.38 5.55,40.35 10,18 26,18 74,18 89,18 18,12 36.52,31.11 36.52,41.78 64.72,22.6 41.98,8.38 53.29,8.25 9.85,8.5 61.5,34.5 71.71,29.68 62.01,40.47 59.72,41.99 59.47,45.93 63.53,45.3 64.8,34.5 56.73,22.44 11.52,45.94 5.43,29.55 8.86,13.3 10.13,34 26.13,34 2.92,60.07 2.67,50.93 2.54,63.75 2.54,79.63 5.46,74.42 1.02,66.93 2.54,47.5 2.16,41.78 2.54,31.5 0.89,34.67 2.92,28.07 1.02,18.03 0.89,12.19 2.55,95.44 2.68,98.87 5.85,115.76 9.28,93.28 24.77,109.16 28.58,109.92 12.07,112.46 13.98,110.93 9.79,111.57 22.36,125.54 73.75,34.13 73.75,31.71 64.72,6.73 74.75,8.25 79.7,7.49 60.61,37.17 56.42,45.8
  pour Top (rank 2): 0,127 0,5 5,0 30.48,0 30.48,44.2 27.94,46.74 8.79,46.74 8.79,53.21 93.85,53.21 93.85,50.42 90.3,46.86 76.83,46.86 70.74,40.77 70.74,10.92 67.06,7.24 65.66,7.24 65.66,38.1 65.15,38.61 64.01,38.61 64.01,42.93 65.15,42.93 65.53,43.31 65.53,44.32 63.12,46.74 40.01,46.74 35.43,42.16 35.43,9.91 32.51,6.99 30.61,6.99 30.61,0 95,0 100,5 100,127 95,132 5,132
  pour Bottom (rank 2): 0,127 0,5 5,0 95,0 100,5 100,127 95,132 5,132
  pour Top: 55.5,0.43 52.73,0.43 52.73,1.35 55.5,1.35
  pour Bottom: 55.5,0.43 55.5,1.35 52.73,1.35 52.73,0.43
  pour Bottom: 47.37,4.32 47.37,0 52.73,0 52.73,4.32
  pour Top: 47.37,4.32 47.37,0 52.73,0 52.73,4.32
GPIO1  (via drill 0.6 pad 1.05)
  Top 0.152: v45.21,2.16 BO_JP2.P$2 47.22,2.16 48.02,2.96 BO_U1.7
  pour Top: 46.99,1.7 46.99,2.62 44.58,2.62 44.58,1.7
  pour Bottom: 44.58,1.7 46.99,1.7 46.99,2.62 44.58,2.62
I_GPIO  (via drill 0.25)
  Top 0.152: v49.53,119.76 50.8,121.03 53.34,121.03 54.23,121.92 v54.74,121.92 | R72.1 31.79,99.44 U7.6
  Bottom 0.152: v49.53,119.76 34.16,104.42 34.16,101.66 31.99,99.46 U7.6 | v54.74,121.92 77.18,121.92 83.91,128.64 JP8.2
LX
  pour Top: 61.21,33.78 61.21,32.38 60.83,32 60.83,29.21 61.72,28.32 62.48,28.32 62.99,28.83 62.99,29.59 62.23,30.35 62.23,32 61.85,32.38 61.85,33.78
MISO  (via drill 0.25)
  Top 0.152: U7.13 25.42,117.24 v25.4,117.22 25.4,115.06 v25.02,114.68 | U8.2 15.57,114.64 v15.62,114.68
  Bottom 0.152: v25.4,117.22 16.09,126.53 JP7.5 | v15.62,114.68 v25.02,114.68
MOSI  (via drill 0.25)
  Top 0.152: v21.21,127 21.21,127.47 JP7.1 | U8.5 21.54,112.09 v21.59,112.14 | v25.27,112.27 27.7,114.7 U7.12
  Bottom 0.152: U7.12 31.68,114.7 21.21,125.16 v21.21,127 | v21.59,112.14 25.15,112.14 v25.27,112.27
MUX1SC0
  Top 0.152: MUX1.6 15.16,85.26 12.72,85.26 R10.1 11.58,84.63 11.58,79.55 9.24,77.21 9.24,75.03 9.75,74.53 U1.3
MUX1SC1  (via drill 0.25)
  Top 0.152: R21.1 19.5,84.65 MUX1.10 22.54,84.65 v22.61,84.58 | v25.75,70.36 U2.3
  Bottom 0.152: v25.75,70.36 25.75,81.44 v22.61,84.58
MUX1SD0  (via drill 0.25)
  Top 0.152: MUX1.5 13.92,84.65 R9.1 12.45,83.18 v12.45,82.17 | U1.2 10.25,74.69 9.75,75.18 9.75,76.94 11.98,79.17 v11.98,79.25
  Bottom 0.152: v11.98,79.25 11.98,81.7 v12.45,82.17
MUX1SD1  (via drill 0.25)
  Top 0.152: R20.1 17.99,87.04 19.73,85.3 MUX1.9 22.9,85.3 v22.99,85.22 | v26.25,70.99 26.25,70.93 U2.2
  Bottom 0.152: v26.25,70.99 26.25,81.95 v22.99,85.22
MUX2SC0
  Top 0.152: MUX2.6 44.68,85.3 R32.1 43.56,84.61 43.56,79.38 41.58,77.39 41.58,74.73 41.75,74.56 U3.3
MUX2SC1  (via drill 0.25)
  Top 0.152: R43.1 51.47,84.65 MUX2.10 54.41,84.65 v54.48,84.58 | U4.3 v57.75,70.36
  Bottom 0.152: v57.75,70.36 57.75,81.31 v54.48,84.58
MUX2SD0  (via drill 0.25)
  Top 0.152: MUX2.5 45.9,84.65 R31.1 44.45,83.2 v44.45,82.17 | U3.2 42.25,74.75 42.01,74.98 42.01,77.02 v43.98,78.99
  Bottom 0.152: v43.98,78.99 43.98,81.7 v44.45,82.17
MUX2SD1  (via drill 0.25)
  Top 0.152: R42.1 49.99,87.04 51.73,85.3 MUX2.9 54.91,85.3 v54.99,85.22 | U4.2 v58.25,70.99
  Bottom 0.152: v58.25,70.99 58.25,81.96 v54.99,85.22
MUX3SC0
  Top 0.152: MUX3.6 76.68,85.3 R54.1 75.56,84.62 75.56,79.5 73.52,77.45 73.52,74.73 73.77,74.47 U5.3
MUX3SC1  (via drill 0.25)
  Top 0.152: R65.1 79.99,88.28 83.62,84.65 MUX3.10 84.87,84.58 v86.36,84.58 | U6.3 v89.75,70.36
  Bottom 0.152: v89.75,70.36 89.75,81.19 v86.36,84.58
MUX3SD0  (via drill 0.25)
  Top 0.152: MUX3.5 77.9,84.65 R53.1 v76.45,82.17 | U5.2 74.27,74.73 74.02,74.98 74.02,77.19 v75.95,79.12
  Bottom 0.152: v75.95,79.12 75.95,81.66 v76.45,82.17
MUX3SD1  (via drill 0.25)
  Top 0.152: R64.1 81.99,87.05 83.74,85.3 MUX3.9 86.78,85.3 v86.87,85.22 | U6.2 v90.25,70.99
  Bottom 0.152: v90.25,70.99 90.25,81.83 v86.87,85.22
N$1
  Top 0.152: U1.16 11.37,69.28 13.84,71.75 13.84,73.56 14.94,74.66 R1.1
N$2
  Top 0.152: R1.2 16.76,74.59 16.76,71.68 JP1.2
N$3
  Top 0.152: R2.2 16.26,71.73 16.26,70.87 17.95,69.17 JP1.3
N$4
  Top 0.152: U1.15 11.8,66.75 12.01,66.96 12.01,69.42 13.9,71.31 R2.1
N$5
  Top 0.152: U1.14 11.89,66.25 12.32,66.67 12.32,68.28 R3.1
N$6
  Top 0.152: U1.13 12.01,65.75 12.02,65.75 R4.1
N$7
  Top 0.152: U1.12 13.25,65.13 13.27,65.13 13.27,65.01 R5.1
N$8
  Top 0.152: U1.11 10.25,64.59 11.77,63.07 13.18,63.07 R6.1
N$9
  Top 0.152: R7.1 14.24,61.6 12.57,61.6 9.75,64.42 U1.10
N$10
  Top 0.152: R8.1 14.99,57.33 13.97,58.35 13.97,60.33 13.34,60.96 12.57,60.96 9.25,64.28 U1.9
N$11
  Top 0.152: R3.2 16.33,67.91 JP1.4
N$12
  Top 0.152: R12.1 29.84,73.5 29.84,71.88 27.37,69.41 U2.16
N$13
  Top 0.152: U2.15 27.89,66.75 28.08,66.94 28.08,69.61 29.75,71.28 R13.1
N$14
  Top 0.152: U2.14 28.02,66.25 28.45,66.67 28.45,68.42 R14.1
N$15
  Top 0.152: U2.13 28.39,65.75 28.39,65.76 28.77,66.14 28.77,66.62 R15.1
N$16
  Top 0.152: R16.1 29.15,65.13 U2.12
N$17
  Top 0.152: U2.11 26.25,64.06 27.44,62.87 R17.1
N$18
  Top 0.152: R18.1 30.25,61.47 28.19,61.47 25.75,63.91 U2.10
N$19
  Top 0.152: R19.1 29.97,58.23 29.97,60.2 29.21,60.96 28.07,60.96 25.25,63.78 U2.9
N$20
  Top 0.152: JP2.2 32.78,71.66 32.78,74.58 R12.2
N$21
  Top 0.152: R4.2 15.47,66.64 JP1.5
N$22
  Top 0.152: R5.2 15.34,65.36 JP1.6
N$23
  Top 0.152: R6.2 16.2,64.09 JP1.7
N$24
  Top 0.152: R7.2 16.26,60.4 16.26,61.21 17.87,62.83 JP1.8
N$25
  Top 0.152: R8.2 16.76,57.4 16.76,60.32 JP1.9
N$26
  Top 0.152: LED1.2-DOUT 7.62,120.35 7.62,112.48 LED2.4-DIN
N$27
  Top 0.152: LED2.2-DOUT 7.79,104.35 12.45,99.69 LED3.4-DIN
N$28  (via drill 0.25)
  Top 0.152: LED3.2-DOUT v7.55,87.12 | v10.79,75.69 12.41,75.69 LED4.4-DIN
  Bottom 0.152: v7.55,87.12 7.55,78.94 v10.79,75.69
N$29
  Top 0.152: JP2.3 32.27,70.91 32.27,71.71 R13.2
N$30
  Top 0.152: R14.2 32.33,67.91 JP2.4
N$31
  Top 0.152: R15.2 31.1,67.13 31.6,66.64 JP2.5
N$32
  Top 0.152: JP2.6 33.98,65.38 31.36,65.38 R16.2
N$33
  Top 0.152: JP2.7 33.95,64.14 32.25,64.14 R17.2
N$34
  Top 0.152: R18.2 32.27,60.28 32.27,61.09 JP2.8
N$35
  Top 0.152: R19.2 32.91,57.41 32.91,60.46 JP2.9
N$36  (via drill 0.25)
  Top 0.152: LED5.4-DIN v11.05,59.65 | LED4.2-DOUT v7.55,71.12
  Bottom 0.152: v7.55,71.12 7.55,63.15 v11.05,59.65
N$37  (via drill 0.25)
  Top 0.152: LED5.2-DOUT 7.55,55.19 v7.62,55.12 | v12.45,44.96 LED6.4-DIN
  Bottom 0.152: v7.62,55.12 12.45,50.29 v12.45,44.96
N$38
  Top 0.152: LED6.2-DOUT 7.62,40.35 7.62,32.22 12.2,27.65 LED7.4-DIN
N$39
  Top 0.152: U3.16 43.37,69.41 45.85,71.88 45.85,73.5 R23.1
N$40
  Top 0.152: U3.15 43.5,66.88 43.81,66.88 44.07,67.14 44.07,69.6 45.76,71.28 R24.1
N$41
  Top 0.152: U3.14 43.38,66.25 43.92,66.25 44.45,66.79 44.45,68.43 R25.1
N$42
  Top 0.152: U3.13 43.9,65.75 R26.1
N$43
  Top 0.152: U3.12 45.15,65.13 R27.1
N$44
  Top 0.152: R28.1 43.93,62.87 42.25,64.56 U3.11
N$45
  Top 0.152: U3.10 41.73,65.11 41.73,64.39 44.52,61.6 46.24,61.6 R29.1
N$46
  Top 0.152: U3.9 41.23,65.11 41.23,64.17 44.45,60.96 45.09,60.96 45.97,60.07 45.97,58.36 R30.1
N$47
  Top 0.152: R23.2 48.78,74.58 48.78,71.67 JP3.2
N$48
  Top 0.152: JP3.3 48.22,70.95 48.22,71.76 R24.2
N$49
  Top 0.152: JP3.4 48.33,67.91 R25.2
N$50
  Top 0.152: R26.2 47.47,66.64 JP3.5
N$51
  Top 0.152: R27.2 47.34,65.36 JP3.6
N$52
  Top 0.152: R28.2 48.2,64.09 JP3.7
N$53
  Top 0.152: R29.2 48.27,60.41 48.27,61.09 JP3.8
N$54
  Top 0.152: JP3.9 48.86,60.41 48.86,57.49 R30.2
N$55
  Top 0.152: LED7.2-DOUT 7.62,24.28 7.62,16.22 12.2,11.65 LED8.4-DIN
N$56
  Top 0.152: LED9.2-DOUT 28.45,19.81 23.91,24.35 LED10.4-DIN
N$57
  Top 0.152: LED10.2-DOUT 28.45,35.7 23.8,40.35 LED11.4-DIN
N$58
  Top 0.152: U4.16 59.37,69.4 61.85,71.88 61.85,73.51 R34.1
N$59
  Top 0.152: U4.15 59.97,66.75 60.08,66.86 60.08,69.61 61.76,71.28 R35.1
N$60
  Top 0.152: U4.14 59.9,66.25 60.45,66.8 60.45,68.43 R36.1
N$61
  Top 0.152: U4.13 59.9,65.75 R37.1
N$62
  Top 0.152: U4.12 58.88,65 R38.1
N$63
  Top 0.152: U4.11 58.25,64.56 59.94,62.87 R39.1
N$64
  Top 0.152: U4.10 57.75,64.3 60.58,61.47 62.25,61.47 R40.1
N$65
  Top 0.152: U4.9 57.25,64.03 60.33,60.96 61.09,60.96 61.85,60.2 61.85,58.36 R41.1
N$66
  Top 0.152: JP4.2 64.86,71.59 64.86,74.51 R34.2
N$67
  Top 0.152: R35.2 64.22,71.76 64.22,70.95 JP4.3
N$68
  Top 0.152: R36.2 64.33,67.91 JP4.4
N$69
  Top 0.152: R37.2 63.47,66.64 JP4.5
N$70
  Top 0.152: JP4.6 63.34,65.36 R38.2
N$71
  Top 0.152: JP4.7 65.92,64.02 64.12,64.02 R39.2
N$72
  Top 0.152: R40.2 64.22,60.24 64.22,61.05 JP4.8
N$73
  Top 0.152: R41.2 63.13,55.51 64.86,57.24 64.86,60.41 JP4.9
N$74  (via drill 0.25)
  Top 0.152: LED11.2-DOUT v28.45,44.96 | LED12.4-DIN 23.55,55.19 v23.62,55.12
  Bottom 0.152: v23.62,55.12 28.45,50.29 v28.45,44.96
N$75  (via drill 0.25)
  Top 0.152: LED13.4-DIN v23.55,71.12 | v27.05,59.69 28.41,59.69 LED12.2-DOUT
  Bottom 0.152: v23.55,71.12 23.55,63.19 v27.05,59.69
N$76
  Top 0.152: LED14.4-DIN 23.8,88.35 28.45,83.7 LED13.2-DOUT
N$77
  Top 0.152: U5.16 75.37,69.4 77.85,71.88 77.85,73.51 R45.1
N$78
  Top 0.152: U5.15 75.97,66.75 76.15,66.93 76.15,69.67 77.76,71.28 R46.1
N$79
  Top 0.152: U5.14 75.9,66.25 76.45,66.8 76.45,68.43 R47.1
N$80
  Top 0.152: U5.13 75.9,65.75 R48.1
N$81
  Top 0.152: U5.12 74.88,65 R49.1
N$82
  Top 0.152: U5.11 74.25,64.56 75.94,62.87 R50.1
N$83
  Top 0.152: U5.10 73.75,64.3 76.58,61.47 78.25,61.47 R51.1
N$84
  Top 0.152: U5.9 73.25,64.04 76.33,60.96 77.09,60.96 77.85,60.2 77.85,58.36 R52.1
N$85
  Top 0.152: R45.2 80.78,74.58 80.78,71.67 JP5.2
N$86
  Top 0.152: JP5.3 82,69.22 80.14,71.08 80.14,71.84 R46.2
N$87
  Top 0.152: R47.2 80.33,67.91 JP5.4
N$88
  Top 0.152: R48.2 79.47,66.64 JP5.5
N$89
  Top 0.152: R49.2 78.98,65.36 JP5.6
N$90
  Top 0.152: JP5.7 80.2,64.09 R50.2
N$91
  Top 0.152: R51.2 80.22,60.24 80.22,61.05 JP5.8
N$92
  Top 0.152: R52.2 79.13,55.51 80.86,57.24 80.86,60.41 JP5.9
N$93
  Top 0.152: LED15.4-DIN 24.06,104.35 24.18,104.22 24.18,97.99 28.45,93.72 LED14.2-DOUT
N$94
  Top 0.152: LED16.4-DIN 23.8,120.35 24.51,119.64 24.51,111.33 28.2,107.65 LED15.2-DOUT
N$95
  Top 0.152: LED17.2-DOUT 39.55,112.22 44.12,107.65 LED18.4-DIN
N$96
  Top 0.152: U6.16 91.37,69.4 93.85,71.88 93.85,74.17 94.34,74.66 R56.1
N$97
  Top 0.152: U6.15 91.94,66.75 92.18,67 92.18,69.7 93.76,71.28 R57.1
N$98
  Top 0.152: U6.14 91.97,66.25 92.49,66.77 92.49,68.47 R58.1
N$99
  Top 0.152: U6.13 92.03,65.75 93.28,67 R59.1
N$100
  Top 0.152: U6.12 93.15,65.13 R60.1
N$101
  Top 0.152: U6.11 90.25,64.56 91.94,62.87 R61.1
N$102
  Top 0.152: U6.10 89.75,64.3 92.57,61.48 94.24,61.48 R62.1
N$103
  Top 0.152: U6.9 89.25,64.04 92.2,61.09 93.09,61.09 93.84,60.34 93.84,58.55 95,57.39 R63.1
N$104
  Top 0.152: R56.2 96.78,74.58 96.78,71.67 JP6.2
N$105
  Top 0.152: JP6.3 97.92,69.17 96.14,70.95 96.14,71.84 R57.2
N$106
  Top 0.152: R58.2 96.33,67.91 JP6.4
N$107
  Top 0.152: R59.2 95.47,66.64 JP6.5
N$108
  Top 0.152: JP6.6 97.98,65.38 95.36,65.38 R60.2
N$109
  Top 0.152: R61.2 94.98,62.95 96.12,64.09 JP6.7
N$110
  Top 0.152: R62.2 95.13,59.02 96.22,60.11 96.22,61.05 JP6.8
N$111
  Top 0.152: R63.2 96.86,57.36 96.86,60.41 JP6.9
N$112
  Top 0.152: LED18.2-DOUT 39.55,102.14 44.45,97.24 LED19.4-DIN
N$113  (via drill 0.25)
  Top 0.152: LED19.2-DOUT v39.55,79.12 | v43.05,75.69 44.41,75.69 LED20.4-DIN
  Bottom 0.152: v39.55,79.12 39.62,79.12 v43.05,75.69
N$114  (via drill 0.25)
  Top 0.152: LED20.2-DOUT 39.55,71.19 v39.62,71.12 | v43.05,59.69 44.41,59.69 LED21.4-DIN
  Bottom 0.152: v39.62,71.12 39.62,63.12 v43.05,59.69
N$115  (via drill 0.25)
  Top 0.152: LED21.2-DOUT 39.55,55.12 v39.62,55.12 | v44.45,44.83 LED22.4-DIN
  Bottom 0.152: v39.62,55.12 44.45,50.29 v44.45,44.83
N$116
  Top 0.152: LED23.4-DIN 44.2,27.65 39.55,32.3 LED22.2-DOUT
N$117
  Top 0.152: LED23.2-DOUT 39.62,24.35 39.62,16.22 44.2,11.65 LED24.4-DIN
N$118
  Top 0.152: LED25.2-DOUT 60.25,11.65 55.55,16.35 LED26.4-DIN
N$119  (via drill 0.35)
  Top 0.152: LED26.2-DOUT 59.09,27.65 v59.05,27.69 | v57.02,40.26 56.93,40.35 LED27.4-DIN
  Bottom 0.152: v59.05,27.69 57.02,29.72 v57.02,40.26
N$120  (via drill 0.25)
  Top 0.152: LED28.4-DIN 55.55,55.19 v55.63,55.12 | v60.45,44.83 LED27.2-DOUT
  Bottom 0.152: v55.63,55.12 60.45,50.29 v60.45,44.83
N$121  (via drill 0.25)
  Top 0.152: LED29.4-DIN v55.55,71.12 | v59.05,59.69 60.41,59.69 LED28.2-DOUT
  Bottom 0.152: v55.55,71.12 55.55,63.2 v59.05,59.69
N$122
  Top 0.152: LED30.4-DIN 55.8,88.35 60.45,83.7 LED29.2-DOUT
N$123
  Top 0.152: LED30.2-DOUT 55.55,96.55 LED31.4-DIN
N$124
  Top 0.152: LED31.2-DOUT 55.55,112.55 LED32.4-DIN
N$125
  Top 0.152: LED33.2-DOUT 76.45,115.45 LED34.4-DIN
N$126
  Top 0.152: LED34.2-DOUT 76.45,99.45 LED35.4-DIN
N$127  (via drill 0.25)
  Top 0.152: LED35.2-DOUT 71.55,79.07 v71.63,78.99 | v75.06,75.69 76.41,75.69 LED36.4-DIN
  Bottom 0.152: v71.63,78.99 71.75,78.99 v75.06,75.69
N$128  (via drill 0.25)
  Top 0.152: LED36.2-DOUT v71.55,71.12 | v75.06,59.69 76.41,59.69 LED37.4-DIN
  Bottom 0.152: v71.55,71.12 71.55,63.2 v75.06,59.69
N$129  (via drill 0.25)
  Top 0.152: LED37.2-DOUT 71.55,55.2 v71.63,55.12 | v76.45,44.96 v76.45,44.95 LED38.4-DIN
  Bottom 0.152: v71.63,55.12 76.45,50.29 v76.45,44.96
N$130
  Top 0.152: LED39.4-DIN 76.2,27.65 74.93,28.92 74.93,37.3 71.88,40.35 LED38.2-DOUT
N$131
  Top 0.152: LED39.2-DOUT 71.62,24.35 71.62,16.22 76.2,11.65 LED40.4-DIN
N$132
  Top 0.152: LED42.4-DIN 87.8,24.35 92.45,19.7 LED41.2-DOUT
N$133
  Top 0.152: LED43.4-DIN 87.88,40.35 92.45,35.78 LED42.2-DOUT
N$134  (via drill 0.25)
  Top 0.152: LED44.4-DIN 87.55,55.2 v87.63,55.12 | v92.46,44.96 LED43.2-DOUT
  Bottom 0.152: v87.63,55.12 92.46,50.29 v92.46,44.96
N$135  (via drill 0.25)
  Top 0.152: LED45.4-DIN v87.55,71.12 | v91.06,59.69 92.41,59.69 LED44.2-DOUT
  Bottom 0.152: v87.55,71.12 87.55,63.2 v91.06,59.69
N$136  (via drill 0.25)
  Top 0.152: LED45.2-DOUT v92.45,76.83 | v87.63,87.12 87.55,87.2 LED46.4-DIN
  Bottom 0.152: v92.45,76.83 92.45,82.3 v87.63,87.12
N$137
  Top 0.152: LED46.2-DOUT 87.55,96.55 LED47.4-DIN
N$138
  Top 0.152: LED47.2-DOUT 87.55,112.55 LED48.4-DIN
N$139
  Top 0.152: LED8.2-DOUT 7.91,8.35 9.27,6.99 13.59,6.99 15.34,8.73 23.17,8.73 LED9.4-DIN
N$140
  Top 0.152: LED24.2-DOUT 39.78,8.35 41.15,6.99 53.85,6.99 55.21,8.35 LED25.4-DIN
N$141
  Top 0.152: LED40.2-DOUT 72.92,6.99 77.42,6.99 79.17,8.73 87.17,8.73 LED41.4-DIN
N$142
  Top 0.152: LED16.2-DOUT 33.23,123.65 34.67,125.09 42.67,125.09 44.12,123.65 LED17.4-DIN
N$143
  Top 0.152: LED32.2-DOUT 62.61,123.65 63.93,124.97 73.23,124.97 74.55,123.65 LED33.4-DIN
N$144
  Top 0.152: LED50.4-DIN 0.85,107.87 4.15,111.17 LED49.2-DOUT
N$145
  Top 0.152: LED50.2-DOUT 4.15,95.17 0.85,91.87 LED51.4-DIN
N$146
  Top 0.152: LED51.2-DOUT 4.15,79.3 0.85,76 LED52.4-DIN
N$147
  Top 0.152: LED52.2-DOUT 4.15,63.34 0.85,60.04 LED53.4-DIN
N$148
  Top 0.152: LED53.2-DOUT 4.15,47.17 0.85,43.87 LED54.4-DIN
N$149
  Top 0.152: LED54.2-DOUT 4.15,31.17 0.85,27.87 LED55.4-DIN
N$150  (via drill 0.25)
  Top 0.152: v11.05,123.57 11.13,123.65 LED1.4-DIN | LED55.2-DOUT 4.19,15.59 v4.19,17.14
  Bottom 0.152: v4.19,17.14 4.22,17.17 4.22,116.74 v11.05,123.57
N$152
  Top 1.016: R81.2 R80.1 C32.2 R82.1
NP_DI  (via drill 0.25)
  Top 0.203: LED49.4-DIN 0.85,116.2 2.75,114.3 5.97,114.3 v6.6,113.67
  Bottom 0.203: v6.6,113.67 9.27,113.67 24.38,98.55 28.36,98.55 U7.7
RST  (via drill 0.25)
  Top 0.152: U8.7 19,114.64 18.41,114.05 18.41,110.58 R76.1 19.52,108.55 v19.05,108.08
  Bottom 0.152: v19.05,108.08 19.05,106.81 21.32,104.54 U7.8
SCL  (via drill 0.25)
  Top 0.152: v50.42,83.31 50.46,83.35 MUX2.12 v59.05,83.35 | MUX1.12 27.01,83.35 v27.05,83.31 | v83.19,83.31 84.76,83.31 MUX3.12 | R68.1 52.05,122.25 U7.18 55.28,125.48 78.33,125.48 81.36,128.51 JP8.4
  Bottom 0.152: U7.18 53.59,120.85 53.59,86.49 v50.42,83.31 v27.05,83.31 | v59.05,83.35 83.15,83.35 v83.19,83.31
SCL1  (via drill 0.6 pad 1.05)
  Top 0.152: BO_U1.10 50.86,3.06 51.28,3.48 53.67,3.48 BO_JP1.P$3 v54.86,3.43
  pour Bottom: 55.5,2.97 53.09,2.97 53.09,3.89 55.5,3.89
  pour Top (no thermals): 53.09,2.97 55.5,2.97 55.5,3.89 53.09,3.89
SDA  (via drill 0.25)
  Top 0.152: MUX3.13 82.83,82.7 v82.8,82.68 | v51.05,82.68 51.08,82.7 MUX2.13 v59.56,82.7 | MUX1.13 v27.56,82.7 | R67.1 49.24,124.88 49.26,124.86 U7.17 53.1,124.86 54.72,126.48 76.79,126.48 78.83,128.51 JP8.6
  Bottom 0.152: U7.17 54.1,122.88 54.1,85.72 v51.05,82.68 51.03,82.7 v27.56,82.7 | v59.56,82.7 82.78,82.7 v82.8,82.68
SDA1  (via drill 0.6 pad 1.05)
  Top 0.152: BO_U1.9 50.06,3.05 49.63,3.48 46.41,3.48 BO_JP2.P$3 v45.21,3.43
  pour Bottom: 44.58,2.97 46.99,2.97 46.99,3.89 44.58,3.89
  pour Top: 44.58,2.97 46.99,2.97 46.99,3.89 44.58,3.89
VDD  (via drill 0.6 pad 1.05)
  Top 0.406: BO_U1.11 52.46,2.96 53.26,2.16 | 53.26,2.16 BO_JP1.P$2 | BO_U1.1 52.46,1.36 53.26,2.16
  Bottom 0.406: BO_C1.1 49.66,3.23 49.81,3.07 51.46,3.07 51.65,3.26 BO_C2.1 52.83,2.12 53.68,2.12 BO_JP1.P$2
  other vias: 54.86,2.16
  pour Top: 53.09,2.59 55.5,2.59 55.5,1.73 53.09,1.73
  pour Bottom: 53.09,2.59 53.09,1.73 55.5,1.73 55.5,2.59
VIN
  Top 0.61: R83.2 60.78,39.08 D1.CATHODE
  pour Top: 57.91,38.48 59.94,38.48 59.94,34.8 60.83,33.91 60.83,32.51 60.45,32.13 60.45,29.46 58.17,29.46 58.17,35.31 57.91,35.56
VPORT
  pour Top: 55.63,35.94 55.63,38.61 54.86,39.37 49.02,39.37 47.5,37.85 47.5,35.69 48.9,34.29 53.98,34.29
WP
  Top 0.152: U8.3 13.98,113.41 TP1.TP R75.2
~MUX3INT1  (via drill 0.25)
  Top 0.152: R66.1 84.8,87.59 MUX3.8 87.28,85.95 v87.38,85.85 | U6.1 90.75,70.3 v90.81,70.36
  Bottom 0.152: v90.81,70.36 90.81,82.42 v87.38,85.85

## Text on the board
bPlace: Header for Particle Argon, Boron or Xenon | Input: 4.5-18V, 25W (max) | D | C | I | V | X | G